# Altium schematic sheet PAGE3 - POWER REGULATOR.SchDoc
size 386 x 246 mm
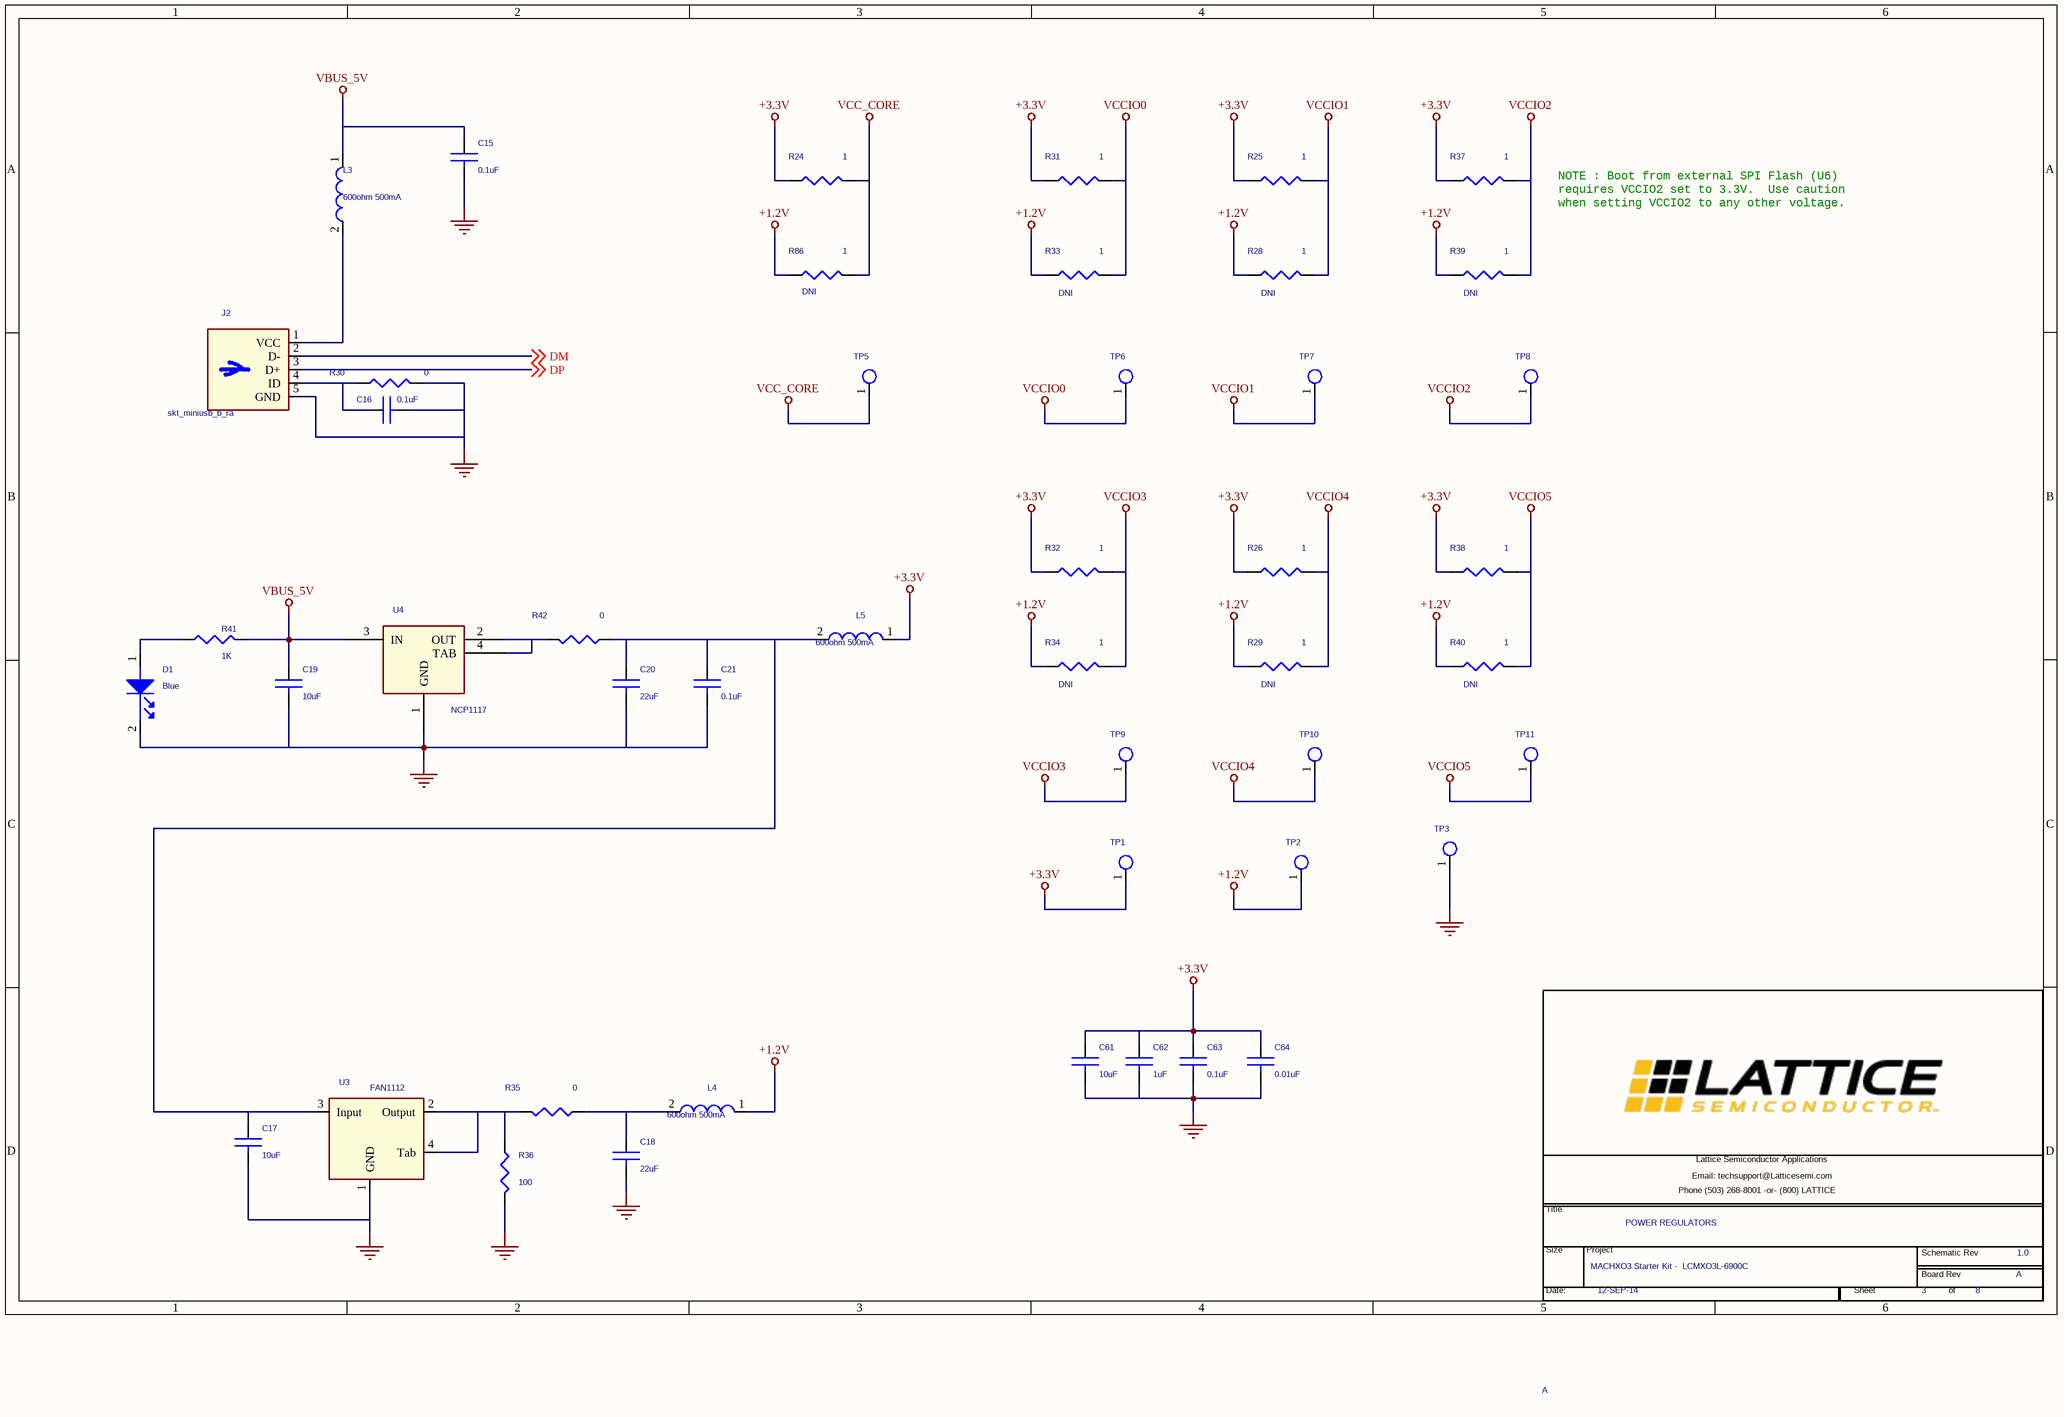
[diagram p0: PAGE3 - POWER REGULATOR.SchDoc]

## Parts
*  Project Name: MACHXO3 Starter Kit -  LCMXO3L-6900C  Title: POWER REGULATORS  Page Number: 3  Page Count: 8  RevCode: 1.0  Page Size: A  Date:: 12-SEP-14  (hidden comment: Lattice Title Block New Brand)  (graphical)
C15  0.1uF  [cc0402]
C16  0.1uF  [cc0402]
C17  10uF  [cc0603]
C18  22uF  [cc0805]
C19  10uF  [cc0603]
C20  22uF  [cc0805]
C21  0.1uF  [cc0402]
C61  10uF  [cc0603]
C62  1uF  [cc0402]
C63  0.1uF  [cc0402]
C64  0.01uF  [cc0402]
D1  Blue  [led_0603]
J2  skt_miniusb_b_ra  [skt_miniusb_b_ra]
L3  600ohm 500mA  [FB0603]
L4  600ohm 500mA  [FB0603]
L5  600ohm 500mA  [FB0603]
R24  1  [cr0603]
R25  1  [cr0603]
R26  1  [cr0603]
R28  1  Assy: DNI  [cr0603]
R29  1  Assy: DNI  [cr0603]
R30  0  [cr0603]
R31  1  [cr0603]
R32  1  [cr0603]
R33  1  Assy: DNI  [cr0603]
R34  1  Assy: DNI  [cr0603]
R35  0  [cr0603]
R36  100  [cr0603]
R37  1  [cr0603]
R38  1  [cr0603]
R39  1  Assy: DNI  [cr0603]
R40  1  Assy: DNI  [cr0603]
R41  1K  [cr0402]
R42  0  [cr0603]
R86  1  Assy: DNI  [cr0603]
TP1  tp_s_40_63  [tp_s_40_63]  (value not drawn)
TP2  tp_s_40_63  [tp_s_40_63]  (value not drawn)
TP3  tp_s_40_63  [tp_s_40_63]  (value not drawn)
TP5  tp_s_40_63  [tp_s_40_63]  (value not drawn)
TP6  tp_s_40_63  [tp_s_40_63]  (value not drawn)
TP7  tp_s_40_63  [tp_s_40_63]  (value not drawn)
TP8  tp_s_40_63  [tp_s_40_63]  (value not drawn)
TP9  tp_s_40_63  [tp_s_40_63]  (value not drawn)
TP10  tp_s_40_63  [tp_s_40_63]  (value not drawn)
TP11  tp_s_40_63  [tp_s_40_63]  (value not drawn)
U3  FAN1112  [sot223_4p]
U4  NCP1117  [sot223_4p]

## Nets
+1.2V: L4.1 R28.1 R29.1 R33.1 R34.1 R39.1 R40.1 R86.1 TP2.1(TP)
+3.3V: C61.1 C62.1 C63.1 C64.1 L5.1 R24.1 R25.1 R26.1 R31.1 R32.1 R37.1 R38.1 TP1.1(TP)
GND: C15.2 C16.2 C17.2 C18.2 C19.2 C20.2 C21.2 C61.2 C62.2 C63.2 C64.2 D1.2(CATHODE) J2.5(GND) R30.2 R36.2 TP3.1(TP) U3.1(GND) U4.1(GND)
VBUS_5V: C15.1 C19.1 L3.1 R41.2 U4.3(IN)
VCC_CORE: R24.2 R86.2 TP5.1(TP)
VCCIO0: R31.2 R33.2 TP6.1(TP)
VCCIO1: R25.2 R28.2 TP7.1(TP)
VCCIO2: R37.2 R39.2 TP8.1(TP)
VCCIO3: R32.2 R34.2 TP9.1(TP)
VCCIO4: R26.2 R29.2 TP10.1(TP)
VCCIO5: R38.2 R40.2 TP11.1(TP)
DM: J2.2(D-) ; off-sheet DM
DP: J2.3(D+) ; off-sheet DP
NetC16_1: C16.1 J2.4(ID) R30.1
NetC17_1: C17.1 C20.1 C21.1 L5.2 R42.1 U3.3(Input)
NetC18_1: C18.1 L4.2 R35.1
NetD1_1: D1.1(ANODE) R41.1
NetJ2_1: J2.1(VCC) L3.2
NetR35_2: R35.2 R36.1 U3.2(Output) U3.4(Tab)
NetR42_2: R42.2 U4.2(OUT) U4.4(TAB)

## Notes on the sheet
- NOTE : Boot from external SPI Flash (U6)
  requires VCCIO2 set to 3.3V.  Use caution
  when setting VCCIO2 to any other voltage.
- (in symbol Lattice Title Block New Brand) Lattice Semiconductor Applications; Email: techsupport@Latticesemi.com; Phone (503) 268-8001 -or- (800) LATTICE; Title; Size; Project; Schematic Rev; Board Rev; Date:; Sheet; of

## Library data of the parts
C15 C16 C21 C63 = 0u1_0402: CAP CER 0.1UF 16V 10% X7R 0402; Manufacturer Part Number: C0402C104K4RACTU; Manufacturer: Kemet; Class: Discrete; Digikey P/N: 399-3521-2-ND
C17 C19 C61 = 10uF_0603: CAP CER 10UF 10V 20% X5R 0603; Manufacturer Part Number: LMK107BJ106MALTD; Manufacturer: Taiyo Yuden; Class: Discrete; Digikey P/N: 587-2562-1-ND
C18 C20 = 22uF_0805: CAP CER 22UF 10V 20% X5R 0805; Manufacturer Part Number: LMK212BJ226MG-T; Manufacturer: Taiyo Yuden; Class: Discrete; Digikey P/N: 587-1958-1-ND
C62 = 1uF_0402: CAP CER 1UF 6.3V 10% X5R 0402; Manufacturer Part Number: C0402C105K9PACTU; Manufacturer: Kemet; Class: Discrete; Digikey P/N: 399-4873-1-ND
C64 = 0_01uF_0402: CAP CER 10000PF 16V 5% X7R 0402; Manufacturer Part Number: C0402C103J4RACTU; Manufacturer: Kemet; Class: Discrete; Digikey P/N: 399-1039-1-ND
D1 = LED_0603_Green: LED 468NM BLUE CLEAR 0603 SMD; Manufacturer: LITE-On INC; Manufacturer Part Number: LTST-C190TBKT; Class: Discrete; Digikey P/N: 160-1646-1-ND
J2 = skt_miniusb_b_ra: CONN MINI USB RCPT RA TYPE B SMD; Manufacturer Part Number: 5075BMR-05-SM-CR; Manufacturer: Neltron; Class: IO
L3-L5 = FB0603: FERRITE CHIP 600 OHM 500MA 0603; Manufacturer Part Number: BLM18AG601SN1D; Manufacturer: Murata; Class: Discrete; Digikey P/N: 490-1014-1-ND
R24-R26 R28 R29 R31-R34 R37-R40 R86 = 1R_0.25W_0603: RES 1.0 OHM .25W 5% 0603 SMD; Manufacturer Part Number: CRCW06031R00JNEAHP; Manufacturer: Vishay; Class: Discrete; Digikey P/N: 541-1.0SACT-ND
R30 R35 R42 = 0R_0603: RES 0.0 OHM 1/10W JUMP 0603 SMD; Manufacturer Part Number: RC0603JR-070RL; Manufacturer: Yageo; Class: Discrete; Digikey P/N: 311-0.0GRTR-ND
R36 = 100R_0603: RES 100 OHM 1/10W 1% 0603 SMD; Manufacturer: Yageo; Manufacturer Part Number: RC0603FR-07100RL; Class: Discrete; Digikey P/N: 311-100HRCT-ND
R41 = 1k_0402: RES 1K OHM 1/10W 1% 0603 SMD; Manufacturer: Yageo; Manufacturer Part Number: RC0603FR-071KL; Class: Discrete; Digikey P/N: 311-1.00KHRCT-ND
TP1-TP3 TP5-TP11 = TP_S_40_63: Square test point, 40mil inner diameter, 63mil outer diameter; Assy: DNI; Class: IO
U3 = FAN1112: IC REG LDO 1.2V 1A SOT223-3; Manufacturer Part Number: FAN1112SX; Manufacturer: Fairchild Semi; Digikey P/N: FAN1112SXCT-ND; Class: IC
U4 = NCP1117: IC REG LDO 3.3V 1A SOT223; Manufacturer: On Semi; Manufacturer Part Number: NCP1117ST33T3G; Digikey P/N: NCP1117ST33T3GOSDKR-ND; Class: IC
* = Lattice Title Block New Brand: Board Rev: A